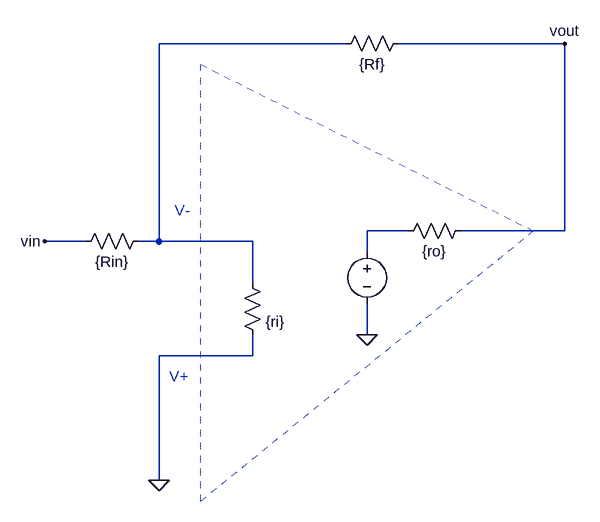
[diagram p0: schematic zAmpop.asc]
zAmpop.asc, the LTspice schematic file:
Version 4
SHEET 1 928 680
WIRE 272 -176 -16 -176
WIRE 608 -176 352 -176
WIRE 368 112 304 112
WIRE 608 112 608 -176
WIRE 608 112 448 112
WIRE -128 128 -192 128
WIRE -16 128 -16 -176
WIRE -16 128 -48 128
WIRE 128 128 -16 128
WIRE 304 144 304 112
WIRE 128 192 128 128
WIRE 304 272 304 224
WIRE 128 304 128 272
WIRE 128 304 -16 304
WIRE -16 496 -16 304
FLAG -192 128 vin
FLAG 608 -176 vout
FLAG -16 496 0
FLAG 304 272 0
SYMBOL res -32 112 R90
WINDOW 0 0 56 Invisible 2
WINDOW 3 32 56 VTop 2
SYMATTR InstName R2
SYMATTR Value {Rin}
SYMBOL res 112 176 R0
WINDOW 0 36 40 Invisible 2
SYMATTR InstName R3
SYMATTR Value {ri}
SYMBOL voltage 304 128 R0
WINDOW 0 24 16 Invisible 2
WINDOW 3 24 96 Invisible 2
SYMATTR InstName V1
SYMBOL res 464 96 R90
WINDOW 0 0 56 Invisible 2
WINDOW 3 32 56 VTop 2
SYMATTR InstName R4
SYMATTR Value {ro}
SYMBOL res 368 -192 R90
WINDOW 0 0 56 Invisible 2
WINDOW 3 32 56 VTop 2
SYMATTR InstName R1
SYMATTR Value {Rf}
TEXT 8 80 Left 2 ;V-
TEXT 0 336 Left 2 ;V+
LINE Normal 48 528 48 -144 2
LINE Normal 560 112 48 528 2
LINE Normal 48 -144 560 112 2

The netlist it stands for:
* zAmpop.asc
R2 N001 vin {Rin}
R3 N001 0 {ri}
V1 N002 0 V
R4 vout N002 {ro}
R1 vout N001 {Rf}
* V-
* V+
.backanno
.end